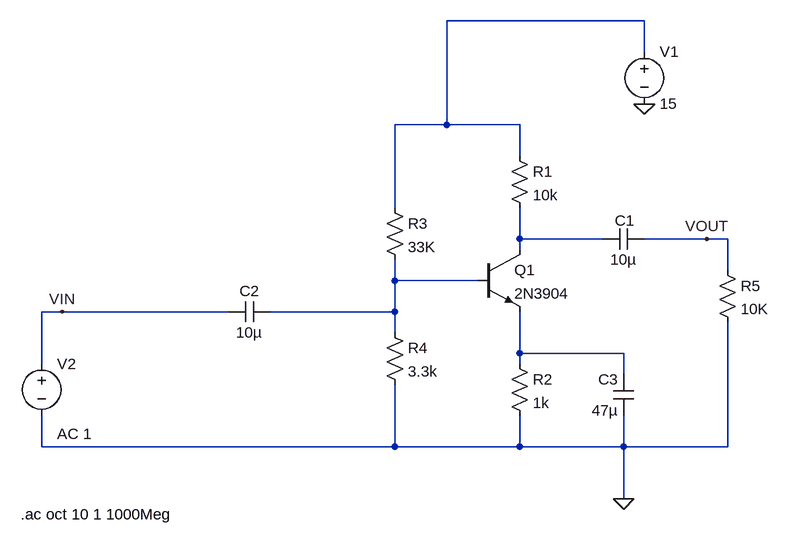
[diagram p0: schematic FREQUENCY RESPONSE OF AMPLIFIER.asc]
FREQUENCY RESPONSE OF AMPLIFIER.asc, the LTspice schematic file:
Version 4
SHEET 1 880 680
WIRE 512 -416 208 -416
WIRE 512 -368 512 -416
WIRE 208 -256 208 -416
WIRE 208 -256 128 -256
WIRE 320 -256 208 -256
WIRE 320 -208 320 -256
WIRE 128 -128 128 -256
WIRE 320 -80 320 -128
WIRE 448 -80 320 -80
WIRE 608 -80 512 -80
WIRE 640 -80 608 -80
WIRE 320 -64 320 -80
WIRE 640 -32 640 -80
WIRE 128 -16 128 -48
WIRE 256 -16 128 -16
WIRE -384 32 -416 32
WIRE -128 32 -384 32
WIRE 128 32 128 -16
WIRE 128 32 -64 32
WIRE 128 64 128 32
WIRE 320 96 320 32
WIRE 480 96 320 96
WIRE -416 112 -416 32
WIRE 320 112 320 96
WIRE 480 128 480 96
WIRE -416 240 -416 192
WIRE 128 240 128 144
WIRE 128 240 -416 240
WIRE 320 240 320 192
WIRE 320 240 128 240
WIRE 480 240 480 192
WIRE 480 240 320 240
WIRE 640 240 640 48
WIRE 640 240 480 240
WIRE 480 320 480 240
WIRE 496 320 480 320
FLAG 480 320 0
FLAG 512 -288 0
FLAG -384 32 VIN
FLAG 608 -80 VOUT
SYMBOL npn 256 -64 R0
SYMATTR InstName Q1
SYMATTR Value 2N3904
SYMBOL res 304 -224 R0
SYMATTR InstName R1
SYMATTR Value 10k
SYMBOL res 304 96 R0
SYMATTR InstName R2
SYMATTR Value 1k
SYMBOL res 112 -144 R0
SYMATTR InstName R3
SYMATTR Value 33K
SYMBOL res 112 48 R0
SYMATTR InstName R4
SYMATTR Value 3.3k
SYMBOL res 624 -48 R0
SYMATTR InstName R5
SYMATTR Value 10K
SYMBOL cap 512 -96 R90
WINDOW 0 3 30 VBottom 2
WINDOW 3 32 32 VTop 2
SYMATTR InstName C1
SYMATTR Value 10µ
SYMBOL cap -64 16 R90
WINDOW 0 0 32 VBottom 2
WINDOW 3 32 32 VTop 2
SYMATTR InstName C2
SYMATTR Value 10µ
SYMBOL cap 496 192 R180
WINDOW 0 24 56 Left 2
WINDOW 3 24 8 Left 2
SYMATTR InstName C3
SYMATTR Value 47µ
SYMBOL voltage 512 -384 R0
WINDOW 123 0 0 Left 0
WINDOW 39 0 0 Left 0
SYMATTR InstName V1
SYMATTR Value 15
SYMBOL voltage -416 96 R0
WINDOW 123 24 124 Left 2
WINDOW 39 0 0 Left 0
SYMATTR Value2 AC 1
SYMATTR InstName V2
SYMATTR Value ""
TEXT -448 344 Left 2 !.ac oct 10 1 1000Meg

The netlist it stands for:
* FREQUENCY RESPONSE OF AMPLIFIER.asc
Q1 N002 N003 N004 0 2N3904
R1 N001 N002 10k
R2 N004 0 1k
R3 N001 N003 33K
R4 N003 0 3.3k
R5 VOUT 0 10K
C1 VOUT N002 10µ
C2 N003 VIN 10µ
C3 0 N004 47µ
V1 N001 0 15
V2 VIN 0 AC 1
.model NPN NPN
.model PNP PNP
.lib standard.bjt
.ac oct 10 1 1000Meg
.backanno
.end